# Altium schematic sheet Accelerometer.SchDoc
size 431 x 279 mm
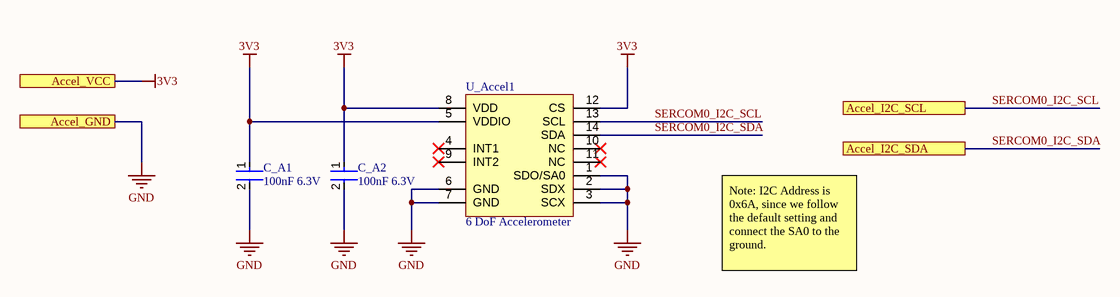
[diagram p0: Accelerometer.SchDoc]

## Parts
C_A1  100nF 6.3V  [FP-GRM033-0_03-IPC_A]
C_A2  100nF 6.3V  [FP-GRM033-0_03-IPC_A]
U_Accel1  6 DoF Accelerometer  [LSM6DSO]

## Ports
Accel_GND, Accel_I2C_SCL, Accel_I2C_SDA, Accel_VCC

## Nets
3V3: C_A1.1 C_A2.1 U_Accel1.5(VDDIO) U_Accel1.8(VDD) U_Accel1.12(CS) ; port Accel_VCC
GND: C_A1.2 C_A2.2 U_Accel1.1(SDO/SA0) U_Accel1.2(SDX) U_Accel1.3(SCX) U_Accel1.6(GND) U_Accel1.7(GND) ; port Accel_GND
SERCOM0_I2C_SCL: U_Accel1.13(SCL) ; port Accel_I2C_SCL
SERCOM0_I2C_SDA: U_Accel1.14(SDA) ; port Accel_I2C_SDA

Not connected (* = marked no-connect by the designer): U_Accel1 4(INT1)* 9(INT2)* 10(NC)* 11(NC)*

## Notes on the sheet
- Note: I2C Address is 0x6A, since we follow the default setting and connect the SA0 to the ground.
- DWG. NO.
- REV.
- SHT.
- THIS DOCUMENT AND THE DATA DISCLOSED HEREIN OR HEREWITH IS THE PROPERTY OF ALTIUM LIMITED AND MAY BE FREELY DISTRIBUTED IN WHOLE. NO RIGHTS ARE RESERVED OR EXPRESS OR IMPLIED WARANTEE GIVEN.
- REVISION
- DESCRIPTION
- DATE
- APPROVED
- ENG:
- APPROVALS
- PROJECT
- DSN:
- CHK:
- REFERENCE DOCUMENTS
- PROJECT REVISION:
- TITLE
- DOCUMENT REVISION:
- DESIGN ITEM:
- BOM:
- FAB DWG:
- PCB DWG:
- ASSY DWG:
- SCALE:
- SIZE
- B
- CAGE CODE
- FILE NAME
- DWG NO.
- SHEET
- OF
- REV

## Library data of the parts
C_A1 C_A2 = CMP-06035-061037-1: Chip Multilayer Ceramic Capacitors for General Purpose, 0201, 0.10uF, X6S, 22%, 20%, 6.3V; Case Code (Imperial): 0201; Min Operating Temperature: -55°C; Thickness: 0.013inch; Width: 0.012inch; Mount: Surface Mount; Height: 0.3mm; Case/Package: 0201; Tolerance: 20%; Weight: 1.2E-05oz; Packaging: Tape and Reel; Package Quantity: 15000; Capacitance: 100nF; Case Code (Metric): 0603; Voltage Rating (DC): 6.3V; Termination: SMD/SMT; Length: 0.024inch; Voltage Rating: 6.3V; Dielectric: X6S; Max Operating Temperature: 105°C
U_Accel1 = LSM6DSO32TR: Accelerometer and 3D Gyroscope 3D Always-On 1.71V to 3.6V 0.55mA 14-Pin LGA T/R; Manufacturer: STMicroelectronics; Supplier 1: Digi-Key; Supplier Part Number 1: 497-LSM6DSO32CT-ND; Manufacturer Part Number: LSM6DSO32TR; RoHS: Yes; Category: Inertial Measurement Units (IMUs); Stock 1: 3420; Pricing 1: 1=4.97000, 10=4.46700, 25=4.22280, 100=3.65990, 500=3.12812 (USD)